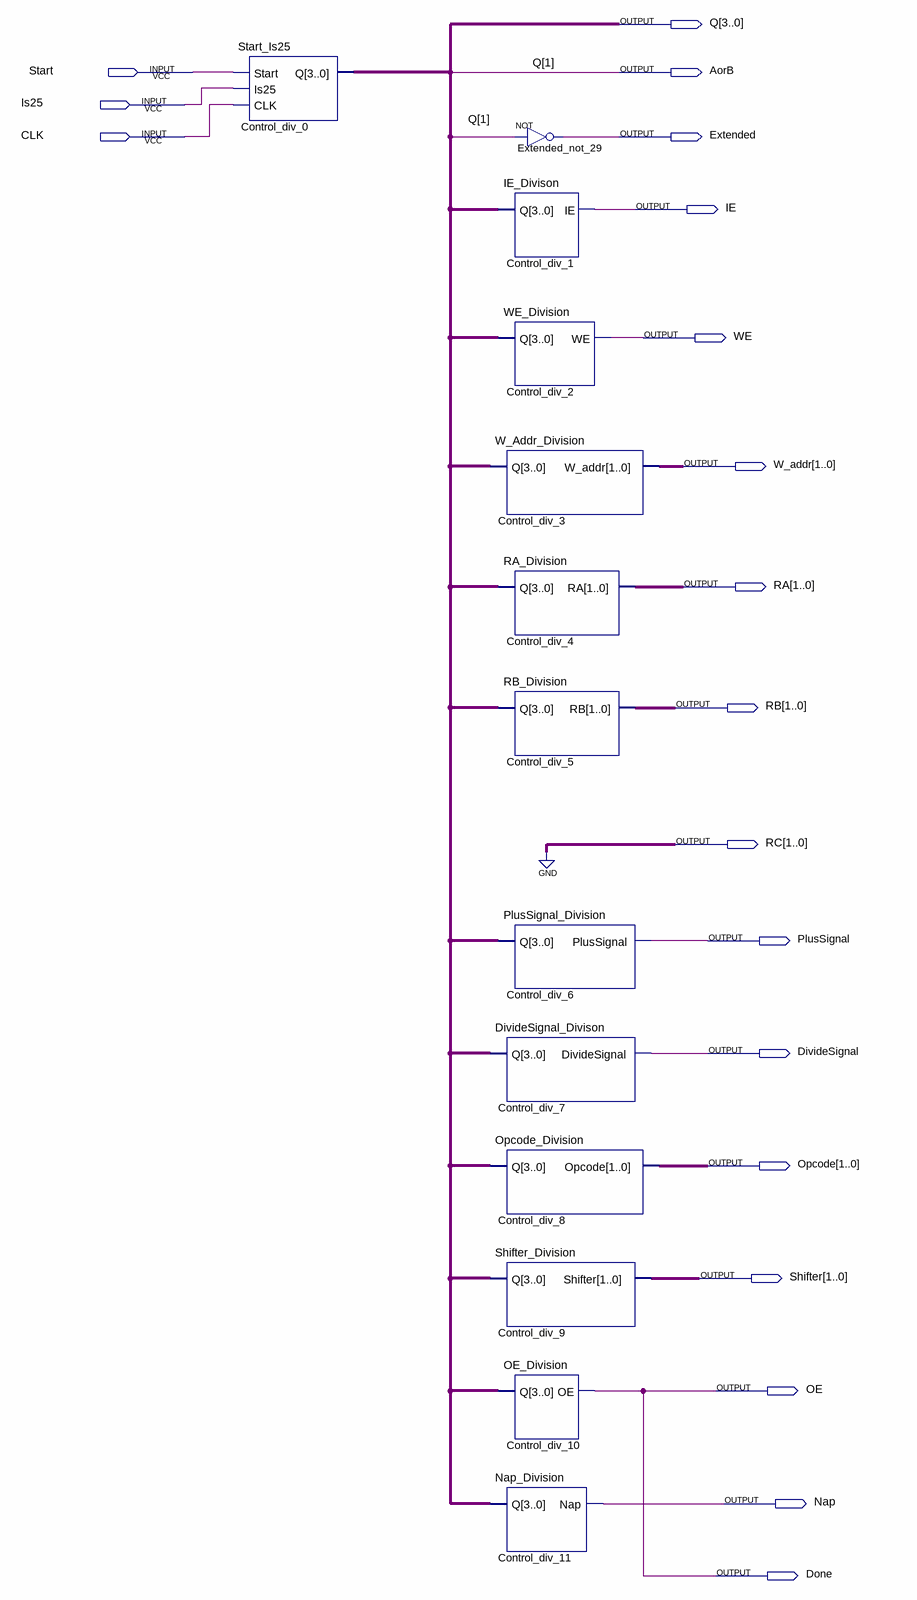
[diagram p0: schematic sheet]
// Quartus schematic Control_Division.bdf as structural Verilog: 13 symbols, 19 pins
module Control_Division (
  input  Start,
  input  Is25,
  input  CLK,
  output [3:0] Q,
  output AorB,
  output Extended,
  output IE,
  output WE,
  output [1:0] W_addr,
  output [1:0] RA,
  output [1:0] RB,
  output [1:0] RC,
  output PlusSignal,
  output DivideSignal,
  output [1:0] Opcode,
  output [1:0] Shifter,
  output OE,
  output Nap,
  output Done
);

  Start_Is25 Control_div_0 (.Start(Start), .Is25(Is25), .CLK(CLK), .Q({Q[3:2], AorB, Q[0]}));
  W_Addr_Division Control_div_3 (.Q({Q[3:2], AorB, Q[0]}), .W_addr(W_addr));
  DivideSignal_Divison Control_div_7 (.Q({Q[3:2], AorB, Q[0]}), .DivideSignal(DivideSignal));
  Opcode_Division Control_div_8 (.Q({Q[3:2], AorB, Q[0]}), .Opcode(Opcode));
  Shifter_Division Control_div_9 (.Q({Q[3:2], AorB, Q[0]}), .Shifter(Shifter));
  Nap_Division Control_div_11 (.Q({Q[3:2], AorB, Q[0]}), .Nap(Nap));
  not Extended_not_29 (Extended, AorB);
  IE_Divison Control_div_1 (.Q({Q[3:2], AorB, Q[0]}), .IE(IE));
  WE_Division Control_div_2 (.Q({Q[3:2], AorB, Q[0]}), .WE(WE));
  RA_Division Control_div_4 (.Q({Q[3:2], AorB, Q[0]}), .RA(RA));
  RB_Division Control_div_5 (.Q({Q[3:2], AorB, Q[0]}), .RB(RB));
  PlusSignal_Division Control_div_6 (.Q({Q[3:2], AorB, Q[0]}), .PlusSignal(PlusSignal));
  OE_Division Control_div_10 (.Q({Q[3:2], AorB, Q[0]}), .OE(Done));

  assign OE = Done;
  assign Q[1] = AorB;
  assign RC = 2'b00;
endmodule
